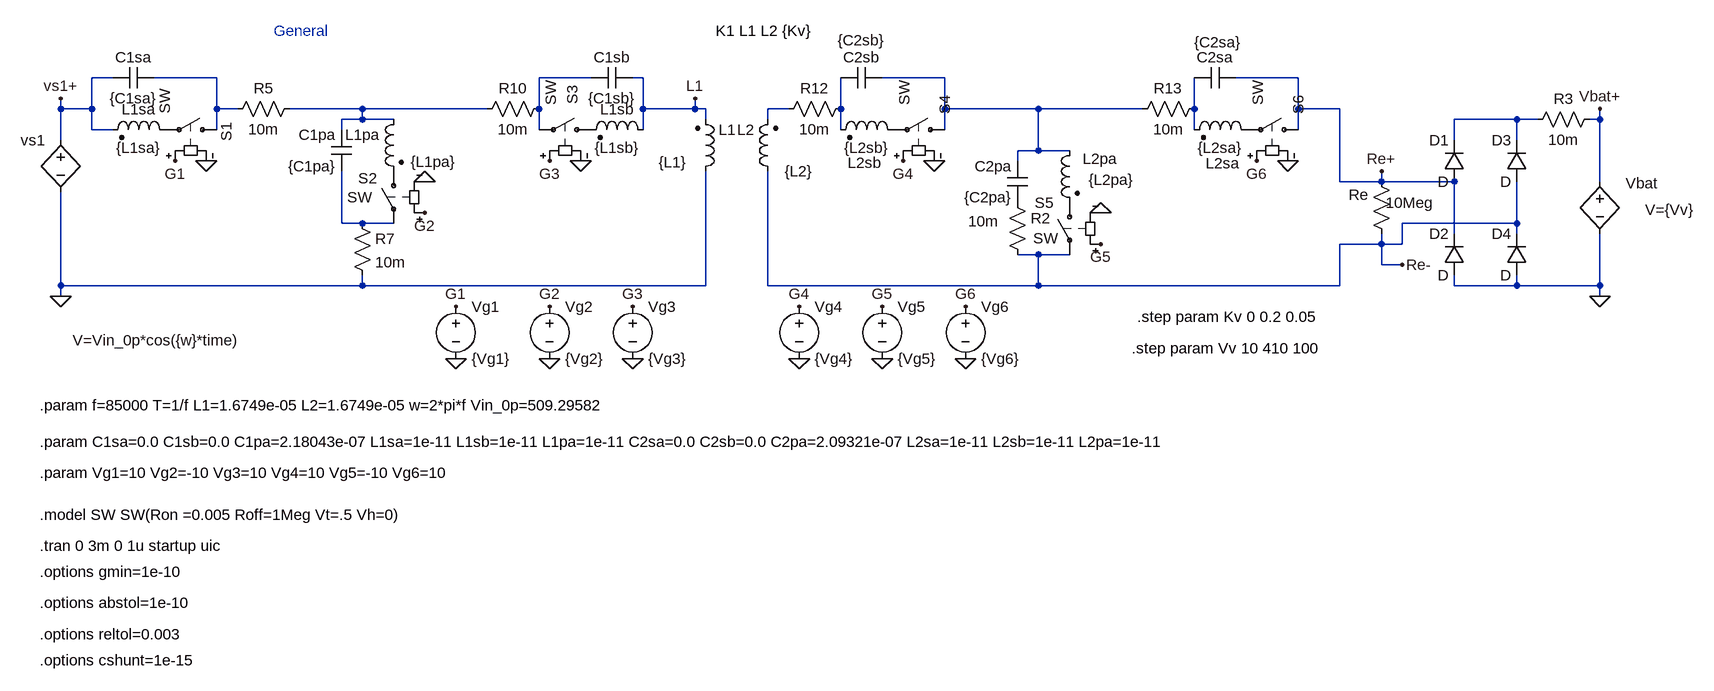
[diagram p0: schematic new_General_v2.asc]
new_General_v2.asc, the LTspice schematic file:
Version 4
SHEET 1 3372 844
WIRE -848 -784 -880 -784
WIRE -688 -784 -784 -784
WIRE -112 -784 -192 -784
WIRE -32 -784 -48 -784
WIRE 432 -784 336 -784
WIRE 976 -784 880 -784
WIRE -928 -736 -928 -752
WIRE -880 -736 -880 -784
WIRE -880 -736 -928 -736
WIRE -688 -736 -688 -784
WIRE -656 -736 -688 -736
WIRE -464 -736 -576 -736
WIRE -272 -736 -464 -736
WIRE -192 -736 -192 -784
WIRE -32 -736 -32 -784
WIRE 48 -736 48 -752
WIRE 48 -736 -32 -736
WIRE 64 -736 48 -736
WIRE 192 -736 160 -736
WIRE 272 -736 272 -784
WIRE 432 -736 432 -784
WIRE 576 -736 432 -736
WIRE 736 -736 576 -736
WIRE 816 -736 816 -784
WIRE 976 -736 976 -784
WIRE 1040 -736 976 -736
WIRE -464 -720 -464 -736
WIRE -464 -720 -496 -720
WIRE -416 -720 -464 -720
WIRE 64 -720 64 -736
WIRE 160 -720 160 -736
WIRE 1312 -720 1216 -720
WIRE 1344 -720 1312 -720
WIRE 1440 -720 1440 -736
WIRE 1440 -720 1424 -720
WIRE -880 -704 -880 -736
WIRE -848 -704 -880 -704
WIRE -688 -704 -688 -736
WIRE -496 -704 -496 -720
WIRE -192 -704 -192 -736
WIRE -32 -704 -32 -736
WIRE 272 -704 272 -736
WIRE 432 -704 432 -736
WIRE 816 -704 816 -736
WIRE 976 -704 976 -736
WIRE -928 -688 -928 -736
WIRE 1216 -688 1216 -720
WIRE 1312 -688 1312 -720
WIRE 576 -672 576 -736
WIRE 576 -672 544 -672
WIRE 624 -672 576 -672
WIRE 544 -656 544 -672
WIRE 1040 -624 1040 -736
WIRE 1104 -624 1104 -640
WIRE 1104 -624 1040 -624
WIRE 1216 -624 1104 -624
WIRE 1440 -624 1440 -720
WIRE -496 -560 -496 -640
WIRE -464 -560 -496 -560
WIRE -416 -560 -464 -560
WIRE 1312 -560 1312 -624
WIRE 1312 -560 1136 -560
WIRE 1216 -544 1216 -624
WIRE 1312 -544 1312 -560
WIRE 1104 -528 1104 -544
WIRE 1104 -528 1040 -528
WIRE 1136 -528 1136 -560
WIRE 1136 -528 1104 -528
WIRE 576 -512 544 -512
WIRE 624 -512 576 -512
WIRE 1104 -496 1104 -528
WIRE 1136 -496 1104 -496
WIRE -928 -464 -928 -608
WIRE -464 -464 -464 -480
WIRE -464 -464 -928 -464
WIRE 64 -464 64 -640
WIRE 64 -464 -464 -464
WIRE 160 -464 160 -640
WIRE 576 -464 576 -512
WIRE 576 -464 160 -464
WIRE 1040 -464 1040 -528
WIRE 1040 -464 576 -464
WIRE 1216 -464 1216 -480
WIRE 1312 -464 1312 -480
WIRE 1312 -464 1216 -464
WIRE 1440 -464 1440 -544
WIRE 1440 -464 1312 -464
WIRE -928 -448 -928 -464
WIRE 1440 -448 1440 -464
FLAG -928 -448 0
FLAG 48 -752 L1
FLAG -928 -752 vs1+
FLAG 1440 -448 0
FLAG 1440 -736 Vbat+
FLAG 1104 -640 Re+
FLAG 1136 -496 Re-
FLAG -752 -656 G1
FLAG -704 -656 0
FLAG -368 -624 0
FLAG -128 -656 0
FLAG 416 -656 0
FLAG 672 -576 0
FLAG 960 -656 0
FLAG 464 -352 0
FLAG 336 -352 0
FLAG 208 -352 0
FLAG -48 -352 0
FLAG -176 -352 0
FLAG -320 -352 0
FLAG -320 -432 G1
FLAG -368 -576 G2
FLAG -176 -432 G2
FLAG -176 -656 G3
FLAG -48 -432 G3
FLAG 368 -656 G4
FLAG 208 -432 G4
FLAG 672 -528 G5
FLAG 336 -432 G5
FLAG 912 -656 G6
FLAG 464 -432 G6
SYMBOL ind2 176 -624 R180
WINDOW 0 36 80 Left 2
WINDOW 3 -53 16 Left 2
SYMATTR InstName L2
SYMATTR Value {L2}
SYMATTR Type ind
SYMBOL bv -928 -704 M0
WINDOW 3 -275 324 Left 2
SYMATTR Value V=Vin_0p*cos({w}*time)
SYMATTR InstName vs1
SYMBOL ind2 48 -624 M180
WINDOW 0 36 80 Left 2
WINDOW 3 -56 30 Left 2
SYMATTR InstName L1
SYMATTR Value {L1}
SYMATTR Type ind
SYMBOL diode 1232 -624 R180
WINDOW 0 24 64 Left 2
WINDOW 3 24 0 Left 2
SYMATTR InstName D1
SYMBOL diode 1232 -480 R180
WINDOW 0 24 64 Left 2
WINDOW 3 24 0 Left 2
SYMATTR InstName D2
SYMBOL diode 1328 -624 R180
WINDOW 0 24 64 Left 2
WINDOW 3 24 0 Left 2
SYMATTR InstName D3
SYMBOL diode 1328 -480 R180
WINDOW 0 24 64 Left 2
WINDOW 3 24 0 Left 2
SYMATTR InstName D4
SYMBOL bv 1440 -640 M0
WINDOW 3 -144 59 Left 2
WINDOW 0 -89 18 Left 2
SYMATTR Value V={Vv}
SYMATTR InstName Vbat
SYMBOL res 1120 -528 R180
WINDOW 0 36 76 Left 2
WINDOW 3 -65 64 Left 2
SYMATTR InstName Re
SYMATTR Value 10Meg
SYMBOL cap -848 -768 R270
WINDOW 0 32 32 VTop 2
WINDOW 3 0 32 VBottom 2
SYMATTR InstName C1sa
SYMATTR Value {C1sa}
SYMBOL res 1440 -736 R90
WINDOW 0 0 56 VBottom 2
WINDOW 3 32 56 VTop 2
SYMATTR InstName R3
SYMATTR Value 10m
SYMBOL ind2 -752 -688 M270
WINDOW 0 32 56 VTop 2
WINDOW 3 4 56 VBottom 2
SYMATTR InstName L1sa
SYMATTR Value {L1sa}
SYMATTR Type ind
SYMBOL res -560 -752 R90
WINDOW 0 0 56 VBottom 2
WINDOW 3 32 56 VTop 2
SYMATTR InstName R5
SYMATTR Value 10m
SYMBOL res -480 -576 R0
SYMATTR InstName R7
SYMATTR Value 10m
SYMBOL cap -480 -640 R180
WINDOW 0 24 56 Left 2
WINDOW 3 24 8 Left 2
SYMATTR InstName C1pa
SYMATTR Value {C1pa}
SYMBOL ind2 -400 -736 M0
WINDOW 3 -81 81 Left 2
SYMATTR Value {L1pa}
SYMATTR InstName L1pa
SYMATTR Type ind
SYMBOL cap -112 -768 R270
WINDOW 0 32 32 VTop 2
WINDOW 3 0 32 VBottom 2
SYMATTR InstName C1sb
SYMATTR Value {C1sb}
SYMBOL ind2 -16 -688 M270
WINDOW 0 32 56 VTop 2
WINDOW 3 4 56 VBottom 2
SYMATTR InstName L1sb
SYMATTR Value {L1sb}
SYMATTR Type ind
SYMBOL res -176 -752 R90
WINDOW 0 0 56 VBottom 2
WINDOW 3 32 56 VTop 2
SYMATTR InstName R10
SYMATTR Value 10m
SYMBOL cap 272 -768 R270
WINDOW 0 32 32 VTop 2
WINDOW 3 89 32 VBottom 2
SYMATTR InstName C2sb
SYMATTR Value {C2sb}
SYMBOL ind2 368 -688 M270
WINDOW 0 -50 59 VTop 2
WINDOW 3 4 56 VBottom 2
SYMATTR InstName L2sb
SYMATTR Value {L2sb}
SYMATTR Type ind
SYMBOL res 288 -752 R90
WINDOW 0 0 56 VBottom 2
WINDOW 3 32 56 VTop 2
SYMATTR InstName R12
SYMATTR Value 10m
SYMBOL res 528 -608 R0
WINDOW 3 -60 45 Left 2
SYMATTR Value 10m
SYMATTR InstName R2
SYMBOL cap 560 -592 R180
WINDOW 0 24 56 Left 2
WINDOW 3 24 8 Left 2
SYMATTR InstName C2pa
SYMATTR Value {C2pa}
SYMBOL ind2 640 -688 M0
WINDOW 0 -58 29 Left 2
WINDOW 3 -84 61 Left 2
SYMATTR InstName L2pa
SYMATTR Value {L2pa}
SYMATTR Type ind
SYMBOL cap 816 -768 R270
WINDOW 0 32 32 VTop 2
WINDOW 3 86 36 VBottom 2
SYMATTR InstName C2sa
SYMATTR Value {C2sa}
SYMBOL ind2 912 -688 M270
WINDOW 0 -51 52 VTop 2
WINDOW 3 4 56 VBottom 2
SYMATTR InstName L2sa
SYMATTR Value {L2sa}
SYMATTR Type ind
SYMBOL res 832 -752 R90
WINDOW 0 0 56 VBottom 2
WINDOW 3 32 56 VTop 2
SYMATTR InstName R13
SYMATTR Value 10m
SYMBOL sw -672 -704 M270
WINDOW 0 -18 1 Left 2
SYMATTR InstName S1
SYMBOL sw -416 -656 M0
WINDOW 0 25 27 Left 2
WINDOW 3 33 56 Left 2
SYMATTR InstName S2
SYMBOL sw -96 -704 M270
WINDOW 0 39 45 Left 2
WINDOW 3 37 78 Left 2
SYMATTR InstName S3
SYMBOL sw 448 -704 M270
WINDOW 3 37 78 Left 2
SYMATTR InstName S4
SYMBOL sw 624 -608 M0
WINDOW 3 18 71 Left 2
SYMATTR InstName S5
SYMBOL sw 992 -704 M270
WINDOW 3 37 78 Left 2
SYMATTR InstName S6
SYMBOL voltage -320 -448 R0
WINDOW 123 0 0 Left 2
WINDOW 39 0 0 Left 2
SYMATTR InstName Vg1
SYMATTR Value {Vg1}
SYMBOL voltage -176 -448 R0
WINDOW 123 0 0 Left 2
WINDOW 39 0 0 Left 2
SYMATTR InstName Vg2
SYMATTR Value {Vg2}
SYMBOL voltage -48 -448 R0
WINDOW 123 0 0 Left 2
WINDOW 39 0 0 Left 2
SYMATTR InstName Vg3
SYMATTR Value {Vg3}
SYMBOL voltage 208 -448 R0
WINDOW 123 0 0 Left 2
WINDOW 39 0 0 Left 2
SYMATTR InstName Vg4
SYMATTR Value {Vg4}
SYMBOL voltage 336 -448 R0
WINDOW 123 0 0 Left 2
WINDOW 39 0 0 Left 2
SYMATTR InstName Vg5
SYMATTR Value {Vg5}
SYMBOL voltage 464 -448 R0
WINDOW 123 0 0 Left 2
WINDOW 39 0 0 Left 2
SYMATTR InstName Vg6
SYMATTR Value {Vg6}
TEXT -960 -64 Left 2 !.tran 0 3m 0 1u startup uic
TEXT -960 -224 Left 2 !.param C1sa=0.0 C1sb=0.0 C1pa=2.18043e-07 L1sa=1e-11 L1sb=1e-11 L1pa=1e-11 C2sa=0.0 C2sb=0.0 C2pa=2.09321e-07 L2sa=1e-11 L2sb=1e-11 L2pa=1e-11
TEXT -600 -856 Left 2 ;General
TEXT -960 -112 Left 2 !.model SW SW(Ron =0.005 Roff=1Meg Vt=.5 Vh=0)
TEXT 80 -856 Left 2 !K1 L1 L2 {Kv}
TEXT 728 -416 Left 2 !.step param Kv 0 0.2 0.05
TEXT 720 -368 Left 2 !.step param Vv 10 410 100
TEXT -960 -280 Left 2 !.param f=85000 T=1/f L1=1.6749e-05 L2=1.6749e-05 w=2*pi*f Vin_0p=509.29582
TEXT -960 -176 Left 2 !.param Vg1=10 Vg2=-10 Vg3=10 Vg4=10 Vg5=-10 Vg6=10
TEXT -960 -24 Left 2 !.options gmin=1e-10
TEXT -960 24 Left 2 !.options abstol=1e-10
TEXT -960 72 Left 2 !.options reltol=0.003
TEXT -960 112 Left 2 !.options cshunt=1e-15

The netlist it stands for:
* new_General_v2.asc
L2 Re- N005 {L2}
B§vs1 vs1+ 0 V=Vin_0p*cos({w}*time)
L1 0 L1 {L1}
D1 Re+ N008 D
D2 0 Re+ D
D3 Re- N008 D
D4 0 Re- D
B§Vbat Vbat+ 0 V={Vv}
Re Re- Re+ 10Meg
C1sa vs1+ N001 {C1sa}
R3 Vbat+ N008 10m
L1sa P001 vs1+ {L1sa}
R5 N004 N001 10m
R7 N009 0 10m
C1pa N009 N004 {C1pa}
L1pa N004 P002 {L1pa}
C1sb N002 L1 {C1sb}
L1sb L1 P003 {L1sb}
R10 N002 N004 10m
C2sb N006 N003 {C2sb}
L2sb P004 N006 {L2sb}
R12 N006 N005 10m
R2 P005 Re- 10m
C2pa P005 N003 {C2pa}
L2pa N003 P006 {L2pa}
C2sa N007 Re+ {C2sa}
L2sa P007 N007 {L2sa}
R13 N007 N003 10m
S1 N001 P001 G1 0 SW
S2 P002 N009 G2 0 SW
S3 P003 N002 G3 0 SW
S4 N003 P004 G4 0 SW
S5 P006 Re- G5 0 SW
S6 Re+ P007 G6 0 SW
Vg1 G1 0 {Vg1}
Vg2 G2 0 {Vg2}
Vg3 G3 0 {Vg3}
Vg4 G4 0 {Vg4}
Vg5 G5 0 {Vg5}
Vg6 G6 0 {Vg6}
.model D D
.lib standard.dio
.tran 0 3m 0 1u startup uic
.param C1sa=0.0 C1sb=0.0 C1pa=2.18043e-07 L1sa=1e-11 L1sb=1e-11 L1pa=1e-11 C2sa=0.0 C2sb=0.0 C2pa=2.09321e-07 L2sa=1e-11 L2sb=1e-11 L2pa=1e-11
* General
.model SW SW(Ron =0.005 Roff=1Meg Vt=.5 Vh=0)
K1 L1 L2 {Kv}
.step param Kv 0 0.2 0.05
.step param Vv 10 410 100
.param f=85000 T=1/f L1=1.6749e-05 L2=1.6749e-05 w=2*pi*f Vin_0p=509.29582
.param Vg1=10 Vg2=-10 Vg3=10 Vg4=10 Vg5=-10 Vg6=10
.options gmin=1e-10
.options abstol=1e-10
.options reltol=0.003
.options cshunt=1e-15
.backanno
.end